# EasyEDA schematic easyeda-schematic.json
TITLE: ESP12 SCT013 Monitor; REV: 1.0; Date: 2018-09-29; Sheet: 1/1; Drawn By: kasparsd
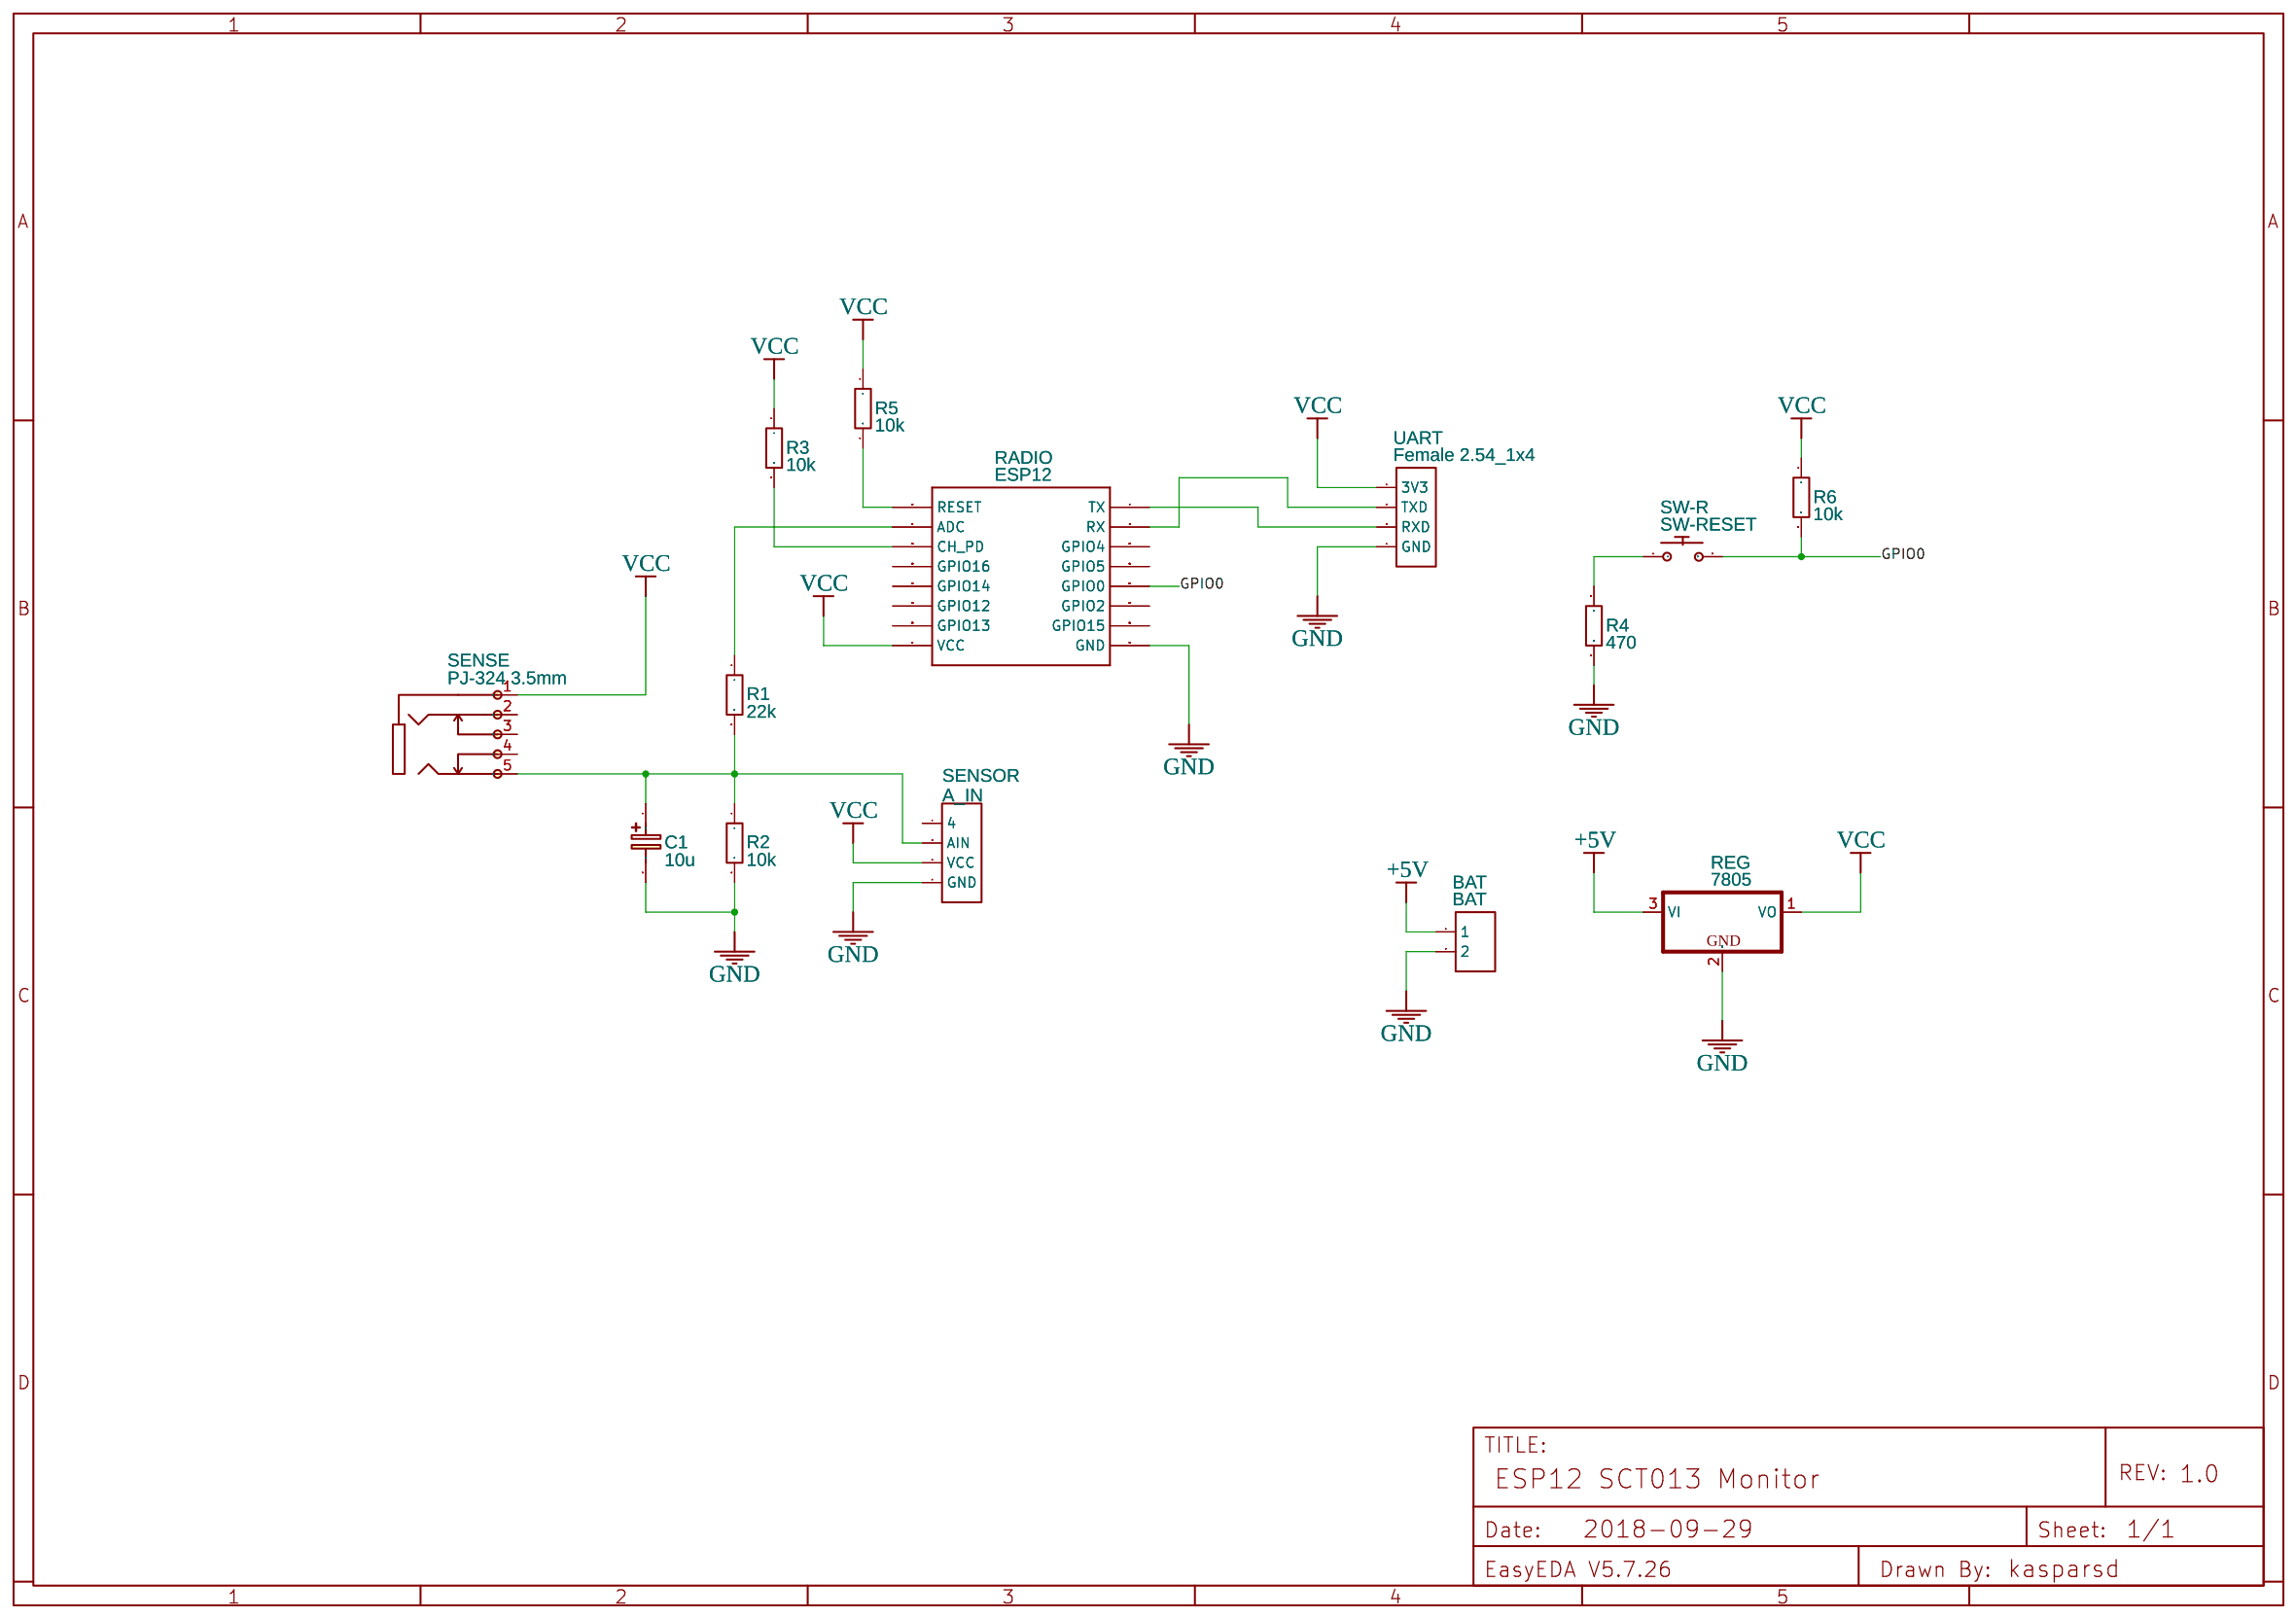
[diagram p0: schematic sheet]

## Parts
BAT  BAT  [HDR-1X2/2.54]
C1  10u  [CAP-D5.0XF2.0]
R1  22k  [AXIAL-0.3]
R2  10k  [AXIAL-0.3]
R3  10k  [AXIAL-0.3]
R4  470  [AXIAL-0.3]
R5  10k  [AXIAL-0.3]
R6  10k  [AXIAL-0.3]
RADIO  ESP12  [ESP12SMD]
REG  7805  [TO92]
SENSE  PJ-324 3.5mm  [AUDIO-PJ324]
SENSOR  A_IN  [HDR-4X1/2.54]
SW-R  SW-RESET  [PUSH BUTTON 2PIN 6X6MM_SMALL_MOD]
UART  Female 2.54_1x4  [HDR-4X1/2.54]

## Library data of the parts
BAT = -: Supplier Part: C49661; Supplier: LCSC; Manufacturer: BOOMELE; Manufacturer Part: 2.54-1*2PFemale; image: //image.lceda.cn/szlcsc/C49661.jpg
C1 = Cap_Electrolytic(TH)_D5.0XF2.0_EU: Contributor: EasyEDA; Manufacturer Part: ?
R1-R6 = Res_AXIAL-0.3(1/8W)_EU: Manufacturer Part: ?
RADIO = -: ESP8266 Wifi module 12; Manufacturer Part: ?
REG = -: Contributor: Adafruit; Manufacturer Part: ?
SENSE = -: Supplier: LCSC; Manufacturer: ReliaPro; Manufacturer Part: PJ-324 3.5mmAudio sockets; image: //image.lceda.cn/szlcsc/C34345.jpg; Contributor: LCSC; Supplier Part: C34345
SENSOR UART = -: Supplier Part: C124413; Supplier: LCSC; Manufacturer: ReliaPro; Manufacturer Part: Header-Female-2.54_1x4
SW-R = -: sourceId: 5QqoKIFDZ; Manufacturer Part: ?

## Nets
+5V: BAT.1 REG.3(VI)
GND: BAT.2 C1.2 R2.2 R4.2 RADIO.GND REG.2(GND) SENSOR.1(GND) UART.4(GND)
VCC: R3.1 R5.1 R6.1 RADIO.VCC REG.1(VO) SENSE.1 SENSOR.2(VCC) UART.1(3V3)
GPIO0: R6.2 RADIO.GPIO0 SW-R.2
Net-(C1-1): C1.1 R1.2 R2.1 SENSE.5 SENSOR.3(AIN)
Net-(R1-1): R1.1 RADIO.ADC
Net-(R3-2): R3.2 RADIO.CH_PD
Net-(R4-1): R4.1 SW-R.1
Net-(R5-2): R5.2 RADIO.RESET
Net-(RADIO-RX): RADIO.RX UART.2(TXD)
Net-(RADIO-TX): RADIO.TX UART.3(RXD)

Not connected (* = marked no-connect by the designer): RADIO GPIO2 GPIO4 GPIO5 GPIO12 GPIO13 GPIO14 GPIO15 GPIO16; SENSE 2 3 4; SENSOR 4
